# EAGLE design arduino stm32 vacuum cleaner (EAGLE 9.0.1)
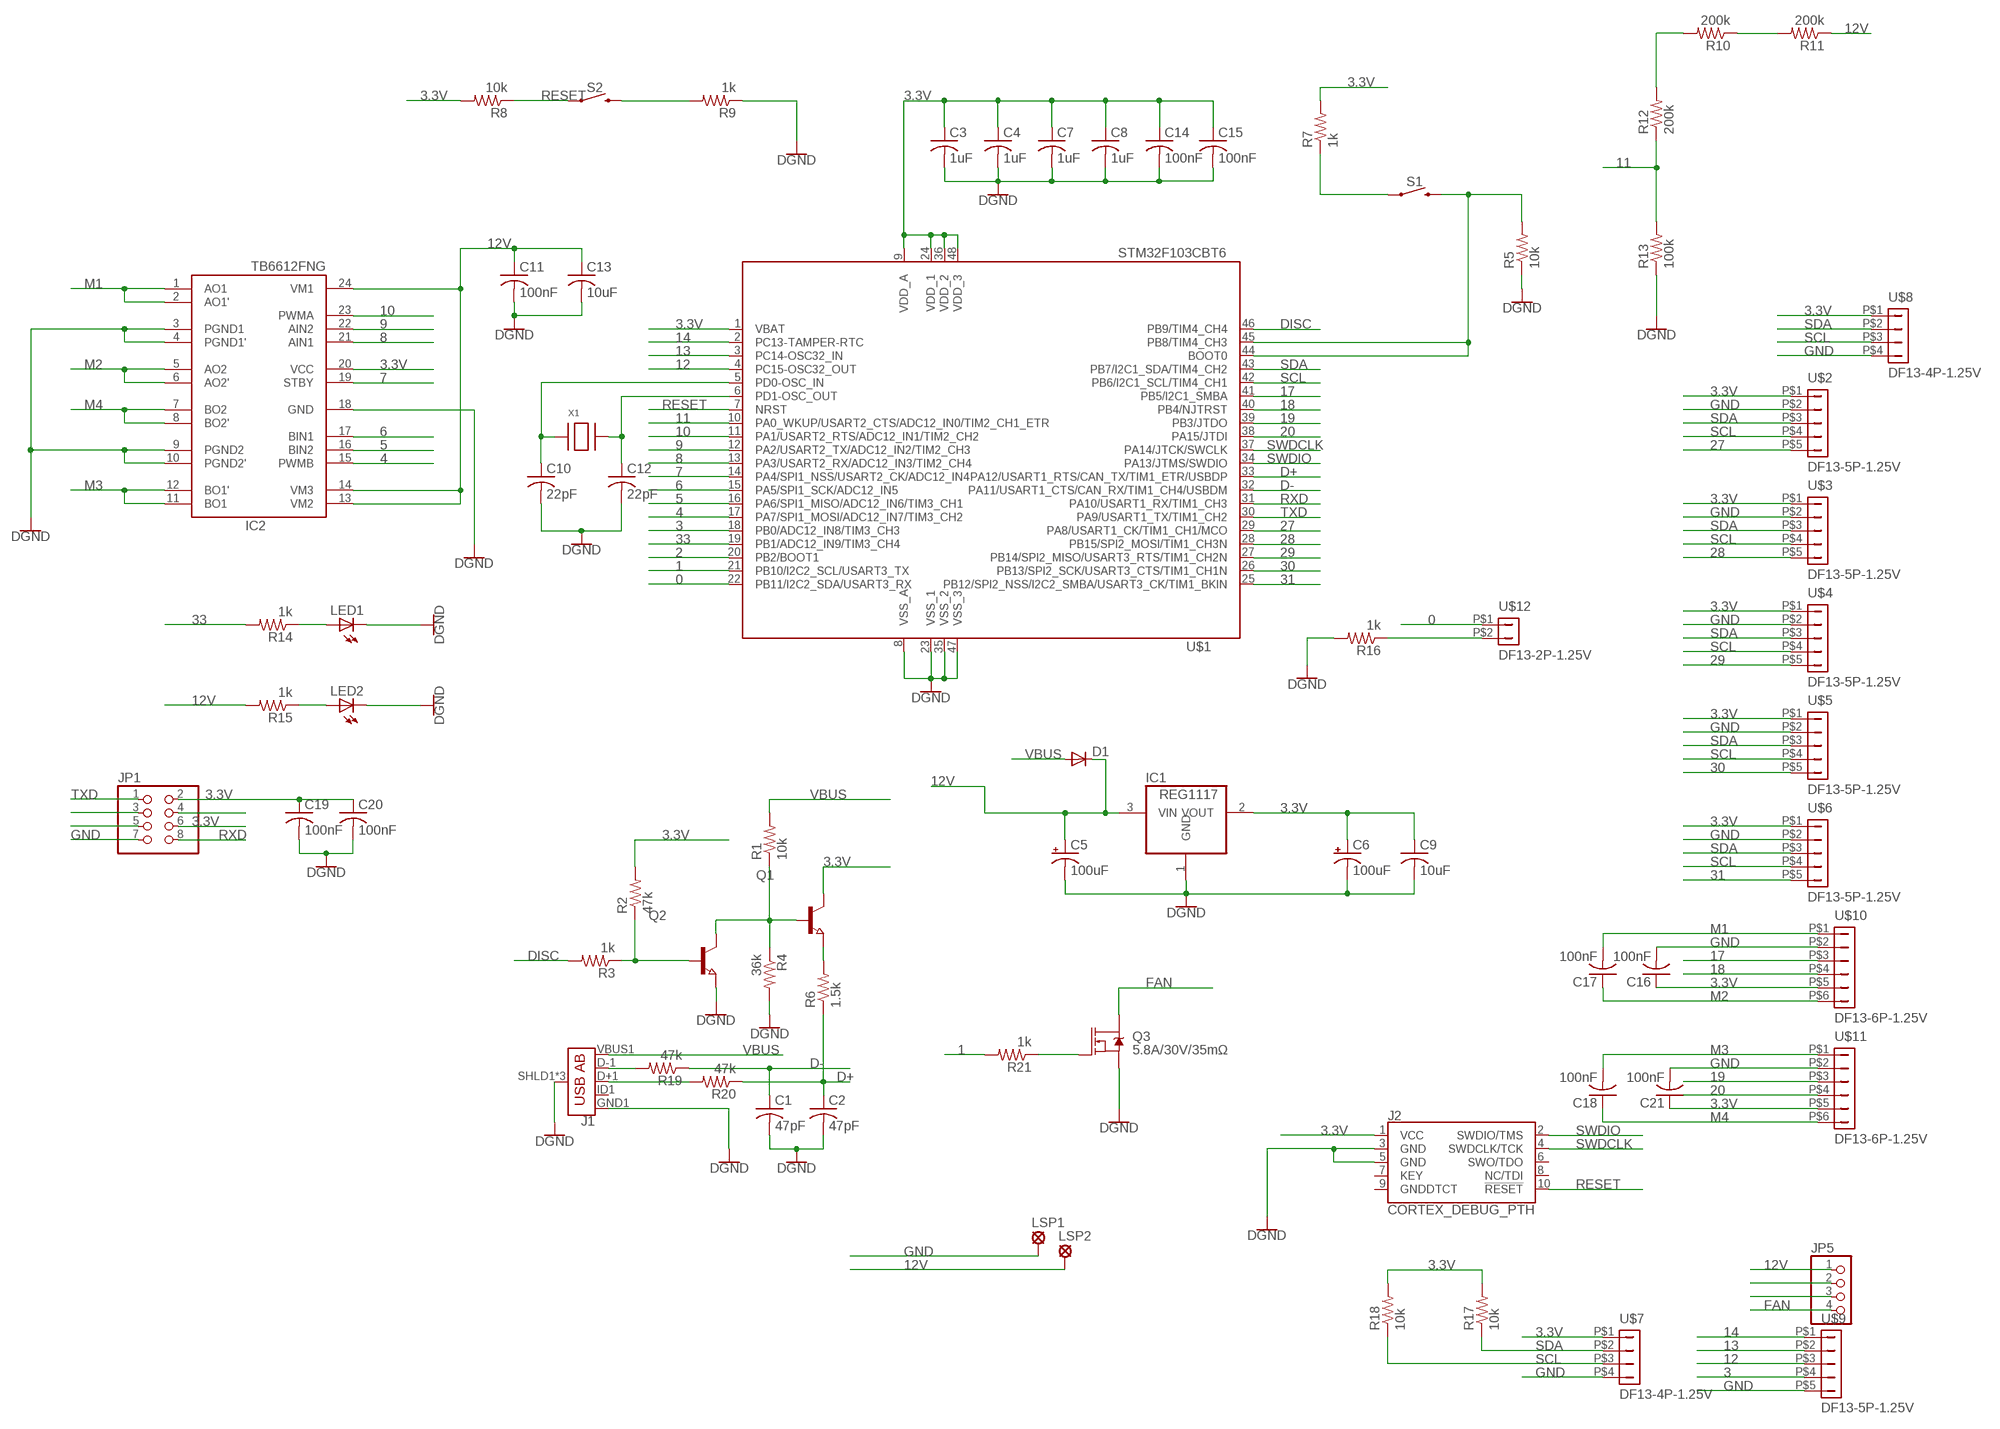
[diagram p0: schematic, sheet 1]

## Parts
C1  47pF  C-USC0805  [C0805]
C2  47pF  C-USC0805  [C0805]
C3  1uF  C-USC0805  [C0805]
C4  1uF  C-USC0805  [C0805]
C5  100uF  CPOL-USCT7343  [CT7343]
C6  100uF  CPOL-USCT7343  [CT7343]
C7  1uF  C-USC0805  [C0805]
C8  1uF  C-USC0805  [C0805]
C9  10uF  C-USC0805  [C0805]
C10  22pF  C-USC0805  [C0805]
C11  100nF  C-USC0805  [C0805]
C12  22pF  C-USC0805  [C0805]
C13  10uF  C-USC0805  [C0805]
C14  100nF  C-USC0805  [C0805]
C15  100nF  C-USC0805  [C0805]
C16  100nF  C-USC0805  [C0805]
C17  100nF  C-USC0805  [C0805]
C18  100nF  C-USC0805  [C0805]
C19  100nF  C-USC0805  [C0805]
C20  100nF  C-USC0805  [C0805]
C21  100nF  C-USC0805  [C0805]
D1  DIODE-SOD123  [SOD123]
IC1  REG1117  [SOT223]
IC2  TB6612FNG  [SSOP24]
J1  USB_AB_SMT  [USB-AB-MICRO-SMD]
J2  CORTEX_DEBUG_PTH  [2X5-PTH-1.27MM]
JP1  PINHD-2X4  [2X04]
JP5  PINHD-1X4  [1X04]
LED1  LEDCHIPLED_0603  [CHIPLED_0603]
LED2  LEDCHIPLED_0603  [CHIPLED_0603]
LSP1  SE14  [SE14]
LSP2  SE14  [SE14]
Q1  NPN-TRANSISTOR_SOT23  [SOT23]
Q2  NPN-TRANSISTOR_SOT23  [SOT23]
Q3  5.8A/30V/35mΩ  MOSFET-NCH-AO3404A  [SOT23-3]
R1  10k  R-US_R0805  [R0805]
R2  47k  R-US_R0805  [R0805]
R3  1k  R-US_R0805  [R0805]
R4  36k  R-US_R0805  [R0805]
R5  10k  R-US_R0805  [R0805]
R6  1.5k  R-US_R0805  [R0805]
R7  1k  R-US_R0805  [R0805]
R8  10k  R-US_R0805  [R0805]
R9  1k  R-US_R0805  [R0805]
R10  200k  R-US_R1206  [R1206]
R11  200k  R-US_R1206  [R1206]
R12  200k  R-US_R1206  [R1206]
R13  100k  R-US_R1206  [R1206]
R14  1k  R-US_R0805  [R0805]
R15  1k  R-US_R0805  [R0805]
R16  1k  R-US_R0805  [R0805]
R17  10k  R-US_R0805  [R0805]
R18  10k  R-US_R0805  [R0805]
R19  47k  R-US_R0805  [R0805]
R20  47k  R-US_R0805  [R0805]
R21  1k  R-US_R0805  [R0805]
S1  MOMENTARY-SWITCH-SPST-SMD-6.0X3.5MM  [TACTILE_SWITCH_SMD_6.0X3.5MM]
S2  MOMENTARY-SWITCH-SPST-SMD-6.0X3.5MM  [TACTILE_SWITCH_SMD_6.0X3.5MM]
U$1  STM32F103CBT6  [STM32_LQFP48]
U$2  DF13-5P-1.25V  [DF13C-5P-1.25V]
U$3  DF13-5P-1.25V  [DF13C-5P-1.25V]
U$4  DF13-5P-1.25V  [DF13C-5P-1.25V]
U$5  DF13-5P-1.25V  [DF13C-5P-1.25V]
U$6  DF13-5P-1.25V  [DF13C-5P-1.25V]
U$7  DF13-4P-1.25V  [DF13C-4P-1.25V]
U$8  DF13-4P-1.25V  [DF13C-4P-1.25V]
U$9  DF13-5P-1.25V  [DF13C-5P-1.25V]
U$10  DF13-6P-1.25V  [DF13C-6P-1.25V]
U$11  DF13-6P-1.25V  [DF13C-6P-1.25V]
U$12  DF13-2P-1.25V  [DF13C-2P-1.25V]
X1  XTALNX5032  [NX5032]

## Nets
0: U$1.22(PB11/I2C2_SDA/USART3_RX) U$12.P$1
1: R21.2 U$1.21(PB10/I2C2_SCL/USART3_TX)
2: U$1.20(PB2/BOOT1)
3: U$1.18(PB0/ADC12_IN8/TIM3_CH3) U$9.P$4
3.3V: C3.1 C4.1 C6.+ C7.1 C8.1 C9.1 C14.1 C15.1 C16.1 C19.1 C20.1 C21.1 IC1.2(VOUT) IC2.20(VCC) J2.1(VCC) JP1.2 JP1.6 Q1.3(C) R2.2 R7.2 R8.2 R17.2 R18.2 U$1.1(VBAT) U$1.9(VDD_A) U$1.24(VDD_1) U$1.36(VDD_2) U$1.48(VDD_3) U$2.P$1 U$3.P$1 U$4.P$1 U$5.P$1 U$6.P$1 U$7.P$1 U$8.P$1 U$10.P$5 U$11.P$5
4: IC2.15(PWMB) U$1.17(PA7/SPI1_MOSI/ADC12_IN7/TIM3_CH2)
5: IC2.16(BIN2) U$1.16(PA6/SPI1_MISO/ADC12_IN6/TIM3_CH1)
6: IC2.17(BIN1) U$1.15(PA5/SPI1_SCK/ADC12_IN5)
7: IC2.19(STBY) U$1.14(PA4/SPI1_NSS/USART2_CK/ADC12_IN4)
8: IC2.21(AIN1) U$1.13(PA3/USART2_RX/ADC12_IN3/TIM2_CH4)
9: IC2.22(AIN2) U$1.12(PA2/USART2_TX/ADC12_IN2/TIM2_CH3)
10: IC2.23(PWMA) U$1.11(PA1/USART2_RTS/ADC12_IN1/TIM2_CH2)
11: R12.1 R13.2 U$1.10(PA0_WKUP/USART2_CTS/ADC12_IN0/TIM2_CH1_ETR)
12: U$1.4(PC15-OSC32_OUT) U$9.P$3
12V: C5.+ C11.1 C13.1 D1.C IC1.3(VIN) IC2.13(VM2) IC2.14(VM3) IC2.24(VM1) JP5.1 LSP2.MP R11.1 R15.2
13: U$1.3(PC14-OSC32_IN) U$9.P$2
14: U$1.2(PC13-TAMPER-RTC) U$9.P$1
17: U$1.41(PB5/I2C1_SMBA) U$10.P$3
18: U$1.40(PB4/NJTRST) U$10.P$4
19: U$1.39(PB3/JTDO) U$11.P$3
20: U$1.38(PA15/JTDI) U$11.P$4
27: U$1.29(PA8/USART1_CK/TIM1_CH1/MCO) U$2.P$5
28: U$1.28(PB15/SPI2_MOSI/TIM1_CH3N) U$3.P$5
29: U$1.27(PB14/SPI2_MISO/USART3_RTS/TIM1_CH2N) U$4.P$5
30: U$1.26(PB13/SPI2_SCK/USART3_CTS/TIM1_CH1N) U$5.P$5
31: U$1.25(PB12/SPI2_NSS/I2C2_SMBA/USART3_CK/TIM1_BKIN) U$6.P$5
33: R14.2 U$1.19(PB1/ADC12_IN9/TIM3_CH4)
D+: C2.1 R6.1 R20.1 U$1.33(PA12/USART1_RTS/CAN_TX/TIM1_ETR/USBDP)
D-: C1.1 R19.1 U$1.32(PA11/USART1_CTS/CAN_RX/TIM1_CH4/USBDM)
DISC: R3.2 U$1.46(PB9/TIM4_CH4)
FAN: JP5.4 Q3.3(D)
GND: C1.2 C2.2 C3.2 C4.2 C5.- C6.- C7.2 C8.2 C9.2 C10.2 C11.2 C12.2 C13.2 C14.2 C15.2 C16.2 C19.2 C20.2 C21.2 IC1.1(GND) IC2.3(PGND1) IC2.4(PGND1') IC2.9(PGND2) IC2.10(PGND2') IC2.18(GND) J1.GND1(GND) J1.SHLD1(SHIELD) J1.SHLD2(SHIELD) J1.SHLD3(SHIELD) J2.3(GND) J2.5(GND) JP1.7 LED1.C LED2.C LSP1.MP Q2.2(E) Q3.2(S) R4.2 R5.1 R9.1 R13.1 R16.2 U$1.8(VSS_A) U$1.23(VSS_1) U$1.35(VSS_2) U$1.47(VSS_3) U$2.P$2 U$3.P$2 U$4.P$2 U$5.P$2 U$6.P$2 U$7.P$4 U$8.P$4 U$9.P$5 U$10.P$2 U$11.P$2 ; supply symbol labelled DGND
M1: C17.2 IC2.1(AO1) IC2.2(AO1') U$10.P$1
M2: C17.1 IC2.5(AO2) IC2.6(AO2') U$10.P$6
M3: C18.2 IC2.11(BO1) IC2.12(BO1') U$11.P$1
M4: C18.1 IC2.7(BO2) IC2.8(BO2') U$11.P$6
N$1: J1.D-1(D-) R19.2
N$2: J1.D+1(D+) R20.2
N$3: R5.2 S1.2 U$1.44(BOOT0) U$1.45(PB8/TIM4_CH3)
N$4: Q1.2(E) R6.2
N$5: Q1.1(B) Q2.3(C) R1.1 R4.1
N$6: C10.1 U$1.5(PD0-OSC_IN) X1.P$1
N$7: R7.1 S1.1
N$8: Q2.1(B) R2.1 R3.1
N$9: JP1.4
N$12: JP5.2
N$13: JP5.3
N$14: R16.1 U$12.P$2
N$15: R10.2 R12.2
N$17: JP1.3
N$19: Q3.1(G) R21.1
N$21: LED1.A R14.1
N$22: LED2.A R15.1
N$41: JP1.5
N$42: R10.1 R11.2
N$54: R9.2 S2.2
N$55: C12.1 U$1.6(PD1-OSC_OUT) X1.P$2
RESET: J2.10(!RESET) R8.1 S2.1 U$1.7(NRST)
RXD: JP1.8 U$1.31(PA10/USART1_RX/TIM1_CH3)
SCL: R18.1 U$1.42(PB6/I2C1_SCL/TIM4_CH1) U$2.P$4 U$3.P$4 U$4.P$4 U$5.P$4 U$6.P$4 U$7.P$3 U$8.P$3
SDA: R17.1 U$1.43(PB7/I2C1_SDA/TIM4_CH2) U$2.P$3 U$3.P$3 U$4.P$3 U$5.P$3 U$6.P$3 U$7.P$2 U$8.P$2
SWDCLK: J2.4(SWDCLK/TCK) U$1.37(PA14/JTCK/SWCLK)
SWDIO: J2.2(SWDIO/TMS) U$1.34(PA13/JTMS/SWDIO)
TXD: JP1.1 U$1.30(PA9/USART1_TX/TIM1_CH2)
VBUS: D1.A J1.VBUS1(VBUS) R1.2
Unconnected: J1.ID1(USBID) J2.6(SWO/TDO) J2.7(KEY) J2.8(NC/TDI) J2.9(GNDDTCT)

## Library data of the parts
C1-C4 C7-C21 = rcl:C-US: CAPACITOR, American symbol; SPICEPREFIX: C
C5 C6 = rcl:CPOL-US: POLARIZED CAPACITOR, American symbol; SPICEPREFIX: C
D1 = diode:DIODE-: DIODE
IC1 = burr-brown:REG1117: 800mA and 1A Low Dropout (LDO) Positive Regulator 1.8V, 2.5V, 2.85V, 3.3V, 5V, and Adj; MPN: REG1117; OC_FARNELL: 1097566; OC_NEWARK: 14P6981
IC2 = adafruit:TB6612FNG: TB6612FNG MOS dual H-bridge motor driver, 1.2A current 3.2A peak 3 or 5v logic and 3-15v motor
J1 = SparkFun-Connectors:USB_AB: USB Type AB Micro Connector OTG-compatible. 5 pins, 3 shield pins SparkFun Products: IOIO-OTG <https://www.sparkfun.com/products/13613> SparkFun SAMD21 Mini Breakout <https://www.sparkfun.com/products/13664>; PROD_ID: CONN-11794
J2 = SparkFun-Connectors:CORTEX_DEBUG: Cortex Debug Connector - 10 pin Supports JTAG debug, Serial Wire debug, and Serial Wire Viewer. PTH and SMD connector options available. General Connector Information <http://infocenter.arm.com/help/topic/com.arm.doc.faqs/attached/13634/cortex_debug_connectors.pdf> Products: PTH Connector <http://www.digikey.com/product-detail/en/cnc-tech/3220-10-0100-00/1175-1627-ND/3883661> -via Digi-Key SparkFun PSoc <https://www.sparkfun.com/products/13229> SparkFun T <https://www.sparkfun.com/products/13810>
JP1 = pinhead:PINHD-2X4: PIN HEADER
JP5 = pinhead:PINHD-1X4: PIN HEADER
LED1 LED2 = adafruit:LED: LED OSRAM: - CHIPLED LG R971, LG N971, LY N971, LG Q971, LY Q971, LO R971, LY R971 LH N974, LH R974 LS Q976, LO Q976, LY Q976 LO Q996 - Hyper CHIPLED LW Q18S LB Q993, LB Q99A, LB R99A - SideLED LS A670, LO A670, LY A670, LG A670, LP A670 LB A673, LV A673, LT A673, LW A673 LH A674 LY A675 LS A676, LA A676, LO A676, LY A676, LW A676 LS A679, LY A679, LG A679 - Hyper Micro SIDELED® LS Y876, LA Y876, LO Y876, LY Y876 LT Y87S - SmartLED LW L88C, LW L88S LB L89C, LB L89S, LG L890 LS L89K, LO L89K, LY L89K LS L896, LA L896, LO L896, LY L896 - TOPLED LS T670, LO T670, LY T670, LG T670, LP T670 LSG T670, LSP T670, LSY T670, LOP T670, LYG T670 LG T671, LOG T671, LSG T671 LB T673, LV T673, LT T673, LW T673 LH T674 LS T676, LA T676, LO T676, LY T676, LB T676, LH T676, LSB T676, LW T676 LB T67C, LV T67C, LT T67C, LS T67K, LO T67K, LY T67K, LW E67C LS E67B, LA E67B, LO E67B, LY E67B, LB E67C, LV E67C, LT E67C LW T67C LS T679, LY T679, LG T679 LS T770, LO T770, LY T770, LG T770, LP T770 LB T773, LV T773, LT T773, LW T773 LH T774 LS E675, LA E675, LY E675, LS T675 LS T776, LA T776, LO T776, LY T776, LB T776 LHGB T686 LT T68C, LB T68C - Hyper Mini TOPLED® LB M676 - Mini TOPLED Santana® LG M470 LS M47K, LO M47K, LY M47K Source: http://www.osram.convergy.de/
LSP1 LSP2 = solpad:SE14: SOLDER PAD E1553, drill 1,4mm, distributor Buerklin, 07F820
Q1 Q2 = semicon-smd-ipc:NPN-TRANSISTOR_: NPN TRANSISTOR
Q3 = SparkFun-DiscreteSemi:MOSFET-NCH: N-channel MOSFETs Voltage controlled devices that allow control of high current outputs. SparkFun Products: SparkFun OpenScale <https://www.sparkfun.com/products/13261> SparkFun Digital Sandbox <https://www.sparkfun.com/products/12651> SparkFun Monster Moto Shield <https://www.sparkfun.com/products/10182> SparkFun MOSFET Power Controller <https://www.sparkfun.com/products/11214>; PROD_ID: TRANS-12988
R1-R21 = rcl:R-US_: RESISTOR, American symbol; SPICEPREFIX: R
S1 S2 = SparkFun-Switches:MOMENTARY-SWITCH-SPST: Momentary Switch (Pushbutton) - SPST Normally-open (NO) SPST momentary switches (buttons, pushbuttons). Variants PTH-12MM - 12mm square, through-hole Momentary Pushbutton Switch - 12mm Square <https://www.sparkfun.com/products/9190> (COM-09190) PTH-6.0MM, PTH-6.0MM-KIT - 6.0mm square, through-hole Mini Pushbutton Switch <https://www.sparkfun.com/products/97> (COM-00097) KIT package intended for soldering kit's - only one side of pads' copper is exposed. PTH-RIGHT-ANGLE-KIT - Right-angle, through-hole Right Angle Tactile Button <https://www.sparkfun.com/products/10791> - Used on SparkFun BigTime Watch Kit <https://www.sparkfun.com/products/11734> SMD-12MM - 12mm square, surface-mount Tactile Button - SMD (12mm) <https://www.sparkfun.com/products/12993> (COM-12993) Used on SparkFun PicoBoard <https://www.sparkfun.com/products/11888> SMD-4.5MM - 4.5mm Square Trackball Switch Used on SparkFun Blackberry Trackballer Breakout <https://www.sparkfun.com/products/13169> SMD-4.6MMX2.8MM - 4.60mm x 2.80mm, surface mount Used on SparkFun SAMD21 Mini Breakout <https://www.sparkfun.com/products/13664> SMD-5.2MM, SMD-5.2-REDUNDANT - 5.2mm square, surface-mount Mini Pushbutton Switch - SMD <https://www.sparkfun.com/products/8720> (COM-08720) Used on Arduino Pro Mini <https://www.sparkfun.com/products/11114> REDUNDANT package connects both switch circuits together SMD-6.0X3.5MM - 6.0 x 3.5mm, surface mount Momentary Reset Switch SMD <https://www.sparkfun.com/products/8229> (COM-08229) SMD-6.2MM-TALL - 6.2mm square, surface mount Tactile Button - SMD (6mm) <https://www.sparkfun.com/products/12992> Used on SparkFun Digital Sandbox <https://www.sparkfun.com/products/12651> SMD-RIGHT-ANGLE - Right-angle, surface mount Used on SparkFun Block for Intel® Edison - Arduino <https://www.sparkfun.com/products/13036>; PROD_ID: SWCH-00815; SF_SKU: COM-08229
U$1 = STM32:STM32F103CBT6
U$2-U$6 U$9 = con-hirose-df13:DF13-5P-1.25: DF13-5P 1.25mm Pitch Miniature Crimping Connector.
U$7 U$8 = con-hirose-df13:DF13-4P-1.25: DF13-4P 1.25mm Pitch Miniature Crimping Connector.
U$10 U$11 = con-hirose-df13:DF13-6P-1.25: DF13-6P 1.25mm Pitch Miniature Crimping Connector.
U$12 = con-hirose-df13:DF13-2P-1.25: DF13-2P 1.25mm Pitch Miniature Crimping Connector.
X1 = adafruit:XTAL: Low cost SMT crystals, no capacitors included http://www.ladyada.net/library/eagle

## Board
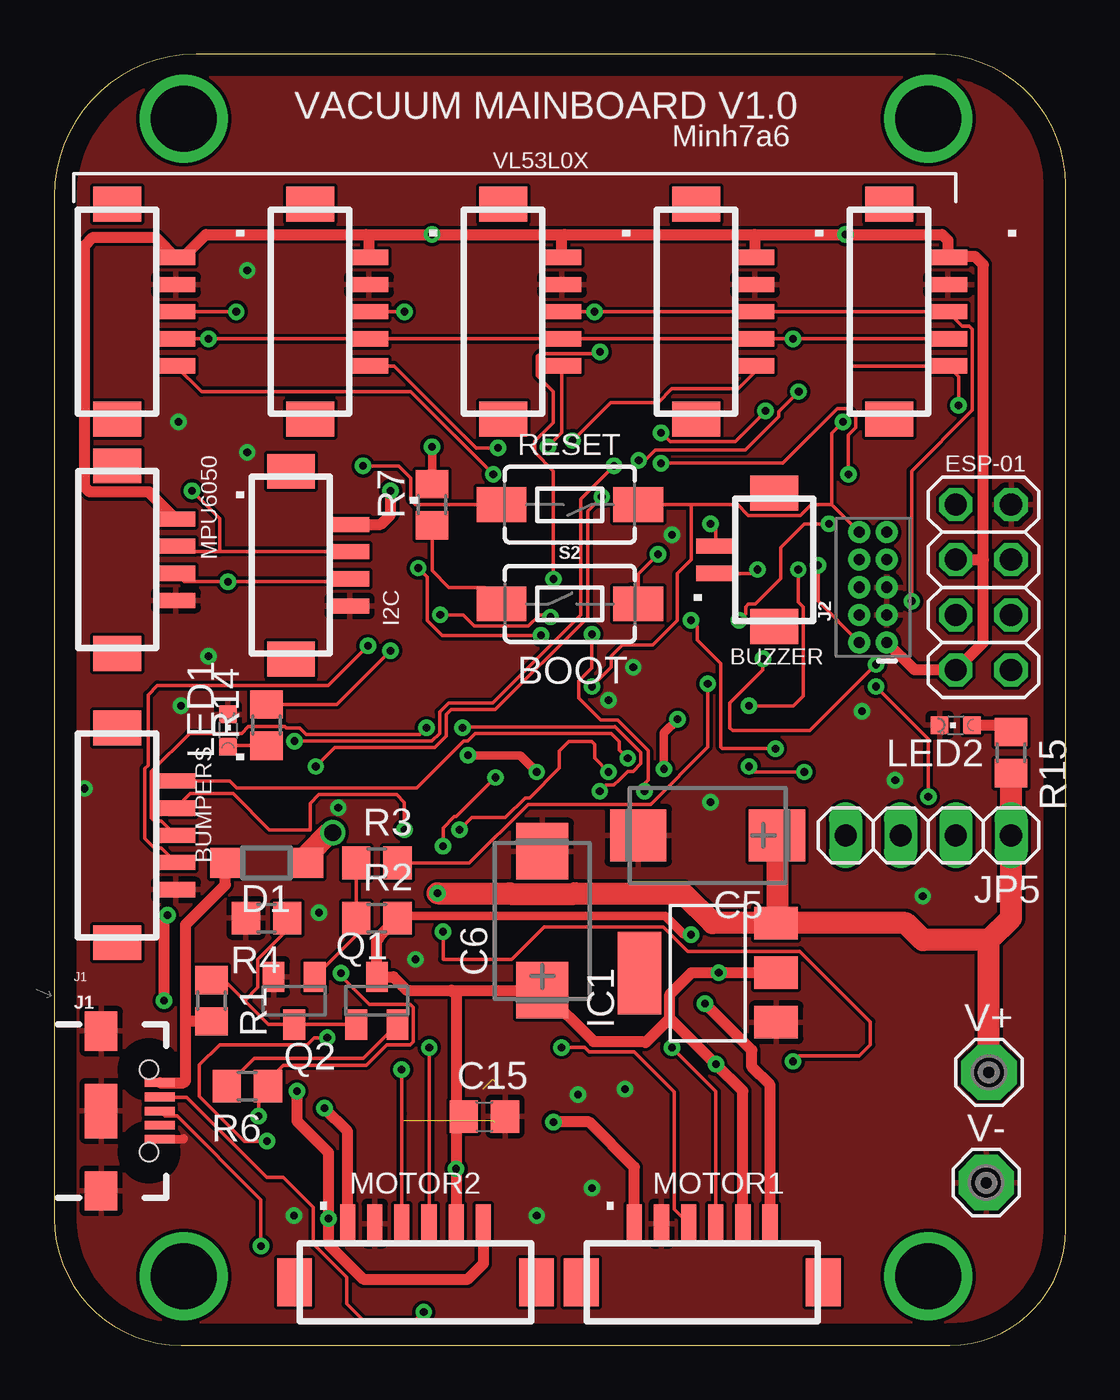
[diagram p1: board, top side]
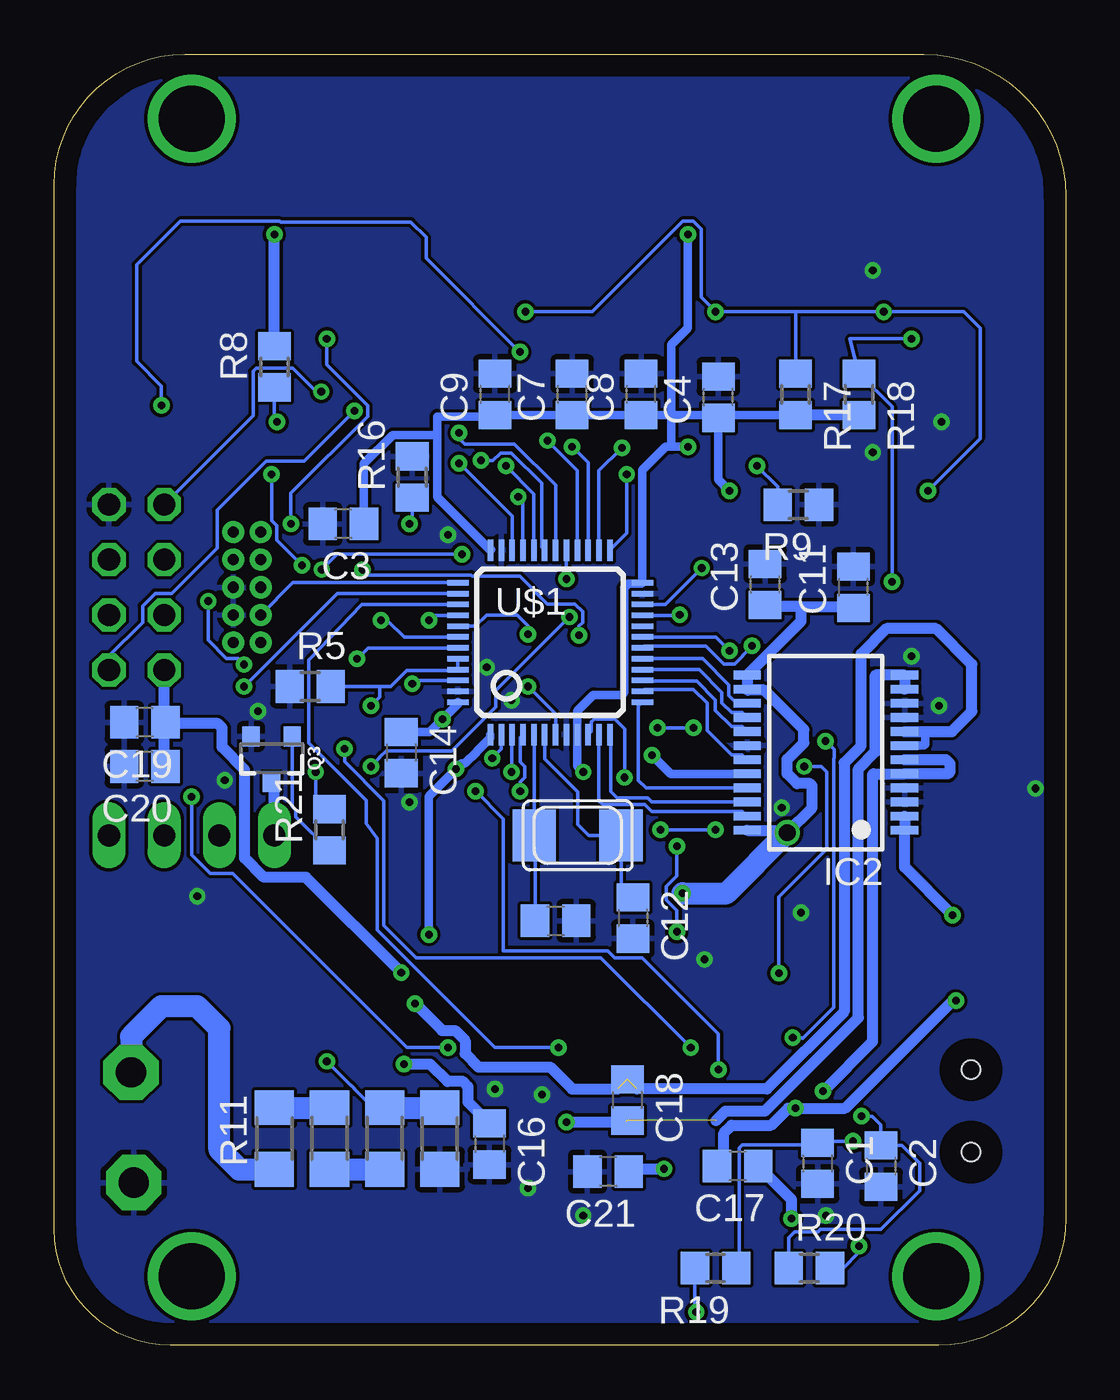
[diagram p2: board, bottom side, seen from below]

Size 46.59 x 59.49 mm. Coordinates in mm from the lower left corner, seen from the top.
Outline: 0,52.96 0,5.84 arc90 5.84,0 41.25,0 arc90 46.59,5.34 46.59,53.48 arc90 40.59,59.49 6.53,59.49 arc90 0,52.96
Copper layers (1*16): Top 0.035mm / dielectric 1.5mm / Bottom 0.035mm
Design rules "default": minimum track width 6mil, minimum drill 0.35mm, track to track 6mil, track to pad 6mil, pad to pad 6mil, via to via 6mil, smd to smd 6mil, copper to edge 40mil, drill to drill 6mil, minimum pad ring 10mil, minimum via ring 8mil, stop-mask expansion 4mil, vias tented up to drill 0mil, thermal gap 10mil

### Footprints (pad centres in the part's own frame; a part is rotated, then mirrored left to right if it is on the bottom)
C0805 = smd 1.3 x 1.5: 1 -0.95,0; 2 0.95,0
CT7343 = smd 2.6 x 2.4: + -3.2,0; - 3.2,0
SOD123 = smd 1.4 x 1.4: A 1.9,0; C -1.9,0
SOT223 = smd 1.499 x 2.007: 1 -2.261,-3.15; 2 0.025,-3.15; 3 2.311,-3.15 | smd 3.81 x 2.007: 4 0,3.15
SSOP24 = smd 0.4 x 1.25: 1 -3.575,-3.625; 2 -2.925,-3.625; 3 -2.275,-3.625; 4 -1.625,-3.625; 5 -0.975,-3.625; 6 -0.325,-3.625; 7 0.325,-3.625; 8 0.975,-3.625; 9 1.625,-3.625; 10 2.275,-3.625; 11 2.925,-3.625; 12 3.575,-3.625; 13 3.575,3.625; 14 2.925,3.625; 15 2.275,3.625; 16 1.625,3.625; 17 0.975,3.625; 18 0.325,3.625; 19 -0.325,3.625; 20 -0.975,3.625; 21 -1.625,3.625; 22 -2.275,3.625; 23 -2.925,3.625; 24 -3.575,3.625
USB-AB-MICRO-SMD = smd 1.4 x 0.4: D+1 2.7,0; D-1 2.7,0.65; GND1 2.7,-1.3; ID1 2.7,-0.65; VBUS1 2.7,1.3 | smd 1.5 x 1.8: SHLD1 0,-3.68; SHLD2 0,3.68 | smd 1.5 x 2.5: SHLD3 0,0 | hole 0.85: 2.2,1.9; 2.2,-1.9
2X5-PTH-1.27MM = drill 0.508 pad 1: 1 -2.54,-0.635; 2 -2.54,0.635; 3 -1.27,-0.635; 4 -1.27,0.635; 5 0,-0.635; 6 0,0.635; 7 1.27,-0.635; 8 1.27,0.635; 9 2.54,-0.635; 10 2.54,0.635
2X04 = drill 1.016 octagon: 1 -3.81,-1.27; 2 -3.81,1.27; 3 -1.27,-1.27; 4 -1.27,1.27; 5 1.27,-1.27; 6 1.27,1.27; 7 3.81,-1.27; 8 3.81,1.27
1X04 = drill 1.016 long: 1 -3.81,0; 2 -1.27,0; 3 1.27,0; 4 3.81,0
CHIPLED_0603 = smd 0.8 x 0.8: A 0,-0.75; C 0,0.75
SE14 = drill 1.397 pad 2.54 octagon: MP 0,0
SOT23 = smd 1 x 1.4: 1 -0.95,-1.1; 2 0.95,-1.1; 3 0,1.1
SOT23-3 = smd 0.8 x 0.9: 1 -0.95,-1; 2 0.95,-1; 3 0,1.1
R0805 = smd 1.3 x 1.5: 1 -0.95,0; 2 0.95,0
R1206 = smd 1.6 x 1.803: 1 -1.422,0; 2 1.422,0
TACTILE_SWITCH_SMD_6.0X3.5MM = smd 2.3 x 1.6: 1 -3.15,0; 2 3.15,0
STM32_LQFP48 = smd 0.254 x 1: 1 -2.75,-4.25; 2 -2.25,-4.25; 3 -1.75,-4.25; 4 -1.25,-4.25; 5 -0.75,-4.25; 6 -0.25,-4.25; 7 0.25,-4.25; 8 0.75,-4.25; 9 1.25,-4.25; 10 1.75,-4.25; 11 2.25,-4.25; 12 2.75,-4.25; 25 2.75,4.25; 26 2.25,4.25; 27 1.75,4.25; 28 1.25,4.25; 29 0.75,4.25; 30 0.25,4.25; 31 -0.25,4.25; 32 -0.75,4.25; 33 -1.25,4.25; 34 -1.75,4.25; 35 -2.25,4.25; 36 -2.75,4.25 | smd 1 x 0.254: 13 4.25,-2.75; 14 4.25,-2.25; 15 4.25,-1.75; 16 4.25,-1.25; 17 4.25,-0.75; 18 4.25,-0.25; 19 4.25,0.25; 20 4.25,0.75; 21 4.25,1.25; 22 4.25,1.75; 23 4.25,2.25; 24 4.25,2.75; 37 -4.25,2.75; 38 -4.25,2.25; 39 -4.25,1.75; 40 -4.25,1.25; 41 -4.25,0.75; 42 -4.25,0.25; 43 -4.25,-0.25; 44 -4.25,-0.75; 45 -4.25,-1.25; 46 -4.25,-1.75; 47 -4.25,-2.25; 48 -4.25,-2.75
DF13C-5P-1.25V = smd 1.6 x 2.2: M$0 4.95,-1.8; M$1 -4.95,-1.8 | smd 0.7 x 1.8: P$1 -2.5,0.9; P$2 -1.25,0.9; P$3 0,0.9; P$4 1.25,0.9; P$5 2.5,0.9
DF13C-4P-1.25V = smd 1.6 x 2.2: M$0 4.325,-1.8; M$1 -4.325,-1.8 | smd 0.7 x 1.8: P$1 -1.875,0.9; P$2 -0.625,0.9; P$3 0.625,0.9; P$4 1.875,0.9
DF13C-6P-1.25V = smd 1.6 x 2.2: M$0 5.575,-1.8; M$1 -5.575,-1.8 | smd 0.7 x 1.8: P$1 -3.125,0.9; P$2 -1.875,0.9; P$3 -0.625,0.9; P$4 0.625,0.9; P$5 1.875,0.9; P$6 3.125,0.9
DF13C-2P-1.25V = smd 1.6 x 2.2: M$0 3.075,-1.8; M$1 -3.075,-1.8 | smd 0.7 x 1.8: P$1 -0.625,0.9; P$2 0.625,0.9
NX5032 = smd 2 x 2.4: P$1 2,0; P$2 -2,0

### Placement (x,y rotation side)
C1  11.43,8.38 270 bottom
C2  8.51,8.25 270 bottom
C3  33.27,37.85 180 bottom
C4  16,43.69 90 bottom
C5  30.1,23.5 180 top
C6  22.48,19.56 90 top
C7  22.73,43.81 90 bottom
C8  19.56,43.81 90 bottom
C9  26.29,43.81 90 bottom
C10  23.5,19.56 0 bottom
C11  9.78,34.92 90 bottom
C12  19.94,19.69 270 bottom
C13  13.84,35.05 90 bottom
C14  30.61,27.3 270 bottom
C15  19.81,10.54 0 top
C16  26.54,9.27 270 bottom
C17  15.11,8.25 180 bottom
C18  20.19,11.3 270 bottom
C19  42.42,28.7 180 bottom
C20  42.42,26.67 180 bottom
C21  21.08,8 180 bottom
D1  9.78,22.23 180 top
IC1  30.1,17.14 90 top
IC2  11.05,27.3 90 bottom
J1  2.16,10.79 0 top
J2  37.72,34.92 90 top
JP1  42.8,34.92 90 top
JP5  40.26,23.5 180 top
LED1  8,28.32 0 top
LED2  41.53,28.57 90 top
LSP1  42.93,7.49 0 top
LSP2  43.05,12.57 0 top
Q1  14.86,15.88 0 top
Q2  11.05,15.88 180 top
Q3  36.58,27.05 180 bottom
R1  7.24,15.88 270 top
R2  14.86,19.69 0 top
R3  14.86,22.23 0 top
R4  9.78,19.69 180 top
R5  34.8,30.35 0 bottom
R6  8.89,11.94 180 top
R7  17.4,38.73 90 top
R8  36.45,45.08 90 bottom
R9  12.32,38.73 180 bottom
R10  33.91,9.53 270 bottom
R11  36.45,9.53 90 bottom
R12  31.37,9.53 270 bottom
R13  28.83,9.53 90 bottom
R14  9.78,28.57 90 top
R15  44.07,27.3 270 top
R16  30.1,40 90 bottom
R17  12.45,43.81 270 bottom
R18  9.53,43.81 270 bottom
R19  16.13,3.56 180 bottom
R20  11.81,3.56 0 bottom
R21  33.91,23.75 90 bottom
S1  23.75,34.16 0 top
S2  23.75,38.73 180 top
U$1  23.75,32.39 0 bottom
U$2  40.26,47.62 270 top
U$3  31.37,47.62 270 top
U$4  22.48,47.62 270 top
U$5  13.59,47.62 270 top
U$6  4.7,47.62 270 top
U$7  12.7,35.94 270 top
U$8  4.7,36.2 270 top
U$9  4.7,23.5 270 top
U$10  16.64,4.7 0 top
U$11  29.84,4.7 0 top
U$12  31.37,36.2 90 top
X1  22.48,23.5 180 bottom

### Tracks (layer width: path | path; a pad name or v marks a point on that pad's centre or on a via)
0  (via drill 0.35)
  Top 0.152: v16.76,35.81 17.17,35.41 17.17,33.4 17.87,32.71 v22.42,32.71 | U$12.P$1 32.21,35.57 v32.38,35.74
  Bottom 0.152: U$1.22 18.44,34.14 v16.76,35.81 | v22.42,32.71 22.42,33.14 22.25,33.3 22.25,33.81 22.61,34.16 23.88,34.16 25.15,35.43 27.35,35.43 27.4,35.49 32.13,35.49 v32.38,35.74
1  (via drill 0.35)
  Top 0.152: v22.86,33.56 22.76,33.66 22.36,33.66 21.84,33.13 19.35,33.13 18.83,33.66 v17.78,33.66 | v32,26.67 32.26,26.42 v34.54,26.42
  Bottom 0.152: U$1.21 17.8,33.64 v17.78,33.66 | v22.86,33.56 26.25,30.16 26.25,29.42 28.29,27.38 31.31,27.38 31.59,27.1 31.59,27.09 v32,26.67 | v34.54,26.42 34.54,25.33 R21.2
3  (via drill 0.35)
  Top 0.152: U$9.P$4 4.93,22.92 4.6,22.92 4.17,23.36 4.17,26.57 4.32,26.72 4.32,29.97 4.75,30.4 12.62,30.4 v14.44,32.22
  Bottom 0.152: U$1.18 19.41,32.22 16.57,32.22 15.75,31.4 15.24,31.4 14.89,31.75 14.89,31.78 v14.44,32.22
3.3V  (via drill 0.35)
  Top 0.381: v17.4,41.4 R7.2 | v19.05,27.18 21.46,27.18 v22.23,26.42 | v29.34,18.92 29,18.92 28.15,19.77 15.89,19.77 R2.2 | v28.08,26.55 28.08,28.21 v28.71,28.84
  Top 0.508: 28.36,15.07 28.36,16.17 29.36,17.17 v30.61,17.17 IC1.2 | 27.23,13.95 27.28,13.99 | 27.28,13.99 28.36,15.07 | R2.2 14.96,18.84 14.96,18.77 14.86,18.66 Q1.3 15.61,16.98 16.23,16.36 18.29,16.36 | 14.35,51.18 6.98,51.18 5.93,50.12 U$6.P$1 4.67,51.05 1.78,51.05 1.39,50.67 1.39,39.55 1.63,39.31 4.35,39.31 U$8.P$1 | 14.35,51.18 14.49,51.04 U$5.P$1 | 14.35,51.18 v17.4,51.18 23.5,51.18 | 23.5,51.18 32.26,51.18 | 32.26,51.18 32.27,51.17 U$3.P$1 | 32.26,51.18 v36.45,51.18 40.89,51.18 41.16,50.92 U$2.P$1 41.2,50.17 42.42,50.17 42.8,49.78 42.8,36.2 | 42.8,36.2 42.8,32.39 JP1.2 39.62,31.11 J2.1 | U$11.P$5 31.72,11.71 v30.48,12.95 28.36,15.07 | 18.29,16.36 C6.+ 24.84,13.99 27.28,13.99 | 18.29,16.36 18.51,16.13 18.51,10.54 | U$7.P$1 15.03,37.82 15.49,38.28 v15.49,39.37 | 18.51,10.54 v18.51,8.13 U$10.P$5 | JP1.6 42.8,36.2 | U$4.P$1 23.38,51.06 23.5,51.18 | C15.1 18.51,10.54
  Bottom 0.381: 26.47,36.66 U$1.36 28.96,39.09 28.96,42.04 | v17.4,41.4 18.16,41.4 | 18.16,41.4 18.41,41.4 19.5,40.32 U$1.24 19.53,35.11 20.14,35.11 20.34,34.9 20.34,30.08 20.45,29.97 21.76,29.97 22.5,29.23 U$1.9 22.5,26.69 v22.23,26.42 | IC2.20 18.2,26.33 v19.05,27.18 | 28.96,42.04 28.96,42.8 26.54,42.8 | 26.54,42.8 26.36,42.8 C9.1 | U$1.48 27.95,29.59 v28.71,28.84 29.29,28.25 C14.1 | v29.34,18.92 29.34,25.3 v28.08,26.55 27.84,26.8 27.69,26.8 27.14,27.35 26.71,27.77 26.5,27.98 U$1.1 | R17.2 16.38,42.86 | 16.38,42.86 C4.1 16,39.88 v15.49,39.37 | 18.29,42.86 C8.1 C7.1 26.48,42.86 26.54,42.8 | 18.29,42.86 16.38,42.86 | v17.4,51.18 17.4,46.86 18.16,46.1 18.16,42.99 18.29,42.86 | 18.16,41.4 18.16,42.74 18.29,42.86 | 28.96,42.04 29.04,41.95 30.99,41.95 32.32,40.61 C3.1
  Bottom 0.508: R8.2 v36.45,51.18 | 41.53,28.64 JP1.2 | v30.61,17.17 35,21.56 36.93,21.56 37.82,22.45 37.82,26.52 38.86,27.56 38.86,28.45 39.05,28.64 41.53,28.64 | R18.2 R17.2 | v30.48,12.95 29.27,12.95 28.48,12.15 27.76,12.15 27.52,11.91 27.52,11.2 C16.1 | C19.1 41.53,28.64 | C20.1 41.53,26.73 41.53,28.64 | C21.1 20,8.13 v18.51,8.13
4
  Bottom 0.152: U$1.17 16.73,31.64 15.53,30.43 15.53,29.93 15.3,29.7 14.8,29.7 IC2.15
5
  Bottom 0.152: U$1.16 16.88,31.14 15.83,30.09 15.83,29.59 15.39,29.15 14.89,29.15 IC2.16
6
  Bottom 0.152: IC2.17 14.89,28.5 15.39,28.5 16.14,29.25 16.14,29.74 17,30.61 19.47,30.61 U$1.15
7
  Bottom 0.152: IC2.19 14.89,27.2 15.39,27.2 16.51,28.32 16.51,29.59 17.14,30.23 19.41,30.23 U$1.14
8
  Bottom 0.152: IC2.21 19.33,25.68 19.68,26.04 19.68,29.45 U$1.13
9
  Bottom 0.152: IC2.22 19.06,25.03 19.26,25.23 20.66,25.23 20.95,25.53 20.95,28.09 U$1.12
10
  Bottom 0.152: IC2.23 14.89,24.6 19.06,24.6 19.38,24.92 21.34,24.92 21.5,25.09 U$1.11
11  (via drill 0.35)
  Top 0.152: v20.32,26.16 18.51,24.36 18.42,24.36 17.91,23.84 v17.91,22.99 | 34.16,13.21 v34.04,13.08 34.29,13.34 37.08,13.34 37.59,13.84 37.59,14.9 34.35,18.15 29.18,18.15 28.05,19.28 22.58,19.28 21.08,17.78 17.91,17.78 v17.91,19.05
  Bottom 0.152: U$1.10 21.86,28.28 21.86,28.73 21.72,28.86 20.78,28.86 20.32,28.41 v20.32,26.16 | v17.91,22.99 17.91,21.62 18.39,21.13 18.39,20.52 17.91,20.04 v17.91,19.05 | R12.1 31.9,10.95 32.78,11.82 32.78,11.84 32.91,11.98 32.93,11.98 v34.04,13.08
  Bottom 1.016: R12.1 R13.2
12  (via drill 0.35)
  Top 0.152: U$9.P$3 4.93,24.17 4.6,24.17 4.47,24.3 4.47,26.44 6.23,28.2 8.63,28.2 8.93,28.5 10.62,28.5 10.68,28.45 11.31,28.45 11.61,28.15 16.84,28.15 v17.14,28.45 | 25.82,28.5 25.83,28.5 | 25.83,28.5 27.02,27.3 27.02,26.8 26.67,26.44 26.41,26.44 26.13,26.16 26.02,26.05 25.78,25.81 25.41,25.81 v25.13,25.53 | 25.83,28.5 18.84,28.5 v18.8,28.45
  Bottom 0.152: U$1.4 25.13,28.01 25.13,26.88 24.92,26.67 24.92,26.16 25.13,25.96 v25.13,25.53 | v18.8,28.45 v17.14,28.45
12V  (via drill 0.35, 0.76)
  Top 1.016: R15.2 JP5.1 44.07,19.69 43.05,18.67 | v12.83,23.62 12.7,23.62 11.68,22.6 D1.C | v17.65,20.83 20.98,20.83 21,20.8 23.95,20.8 23.98,20.83 28.96,20.83 30.33,19.46 IC1.3 | C5.+ 33.3,19.51 IC1.3 | IC1.3 39.22,19.46 40.01,18.67 43.05,18.67 | LSP2.MP 43.05,18.67
  Bottom 0.508: IC2.24 12.94,23.73 v12.83,23.62 11.68,24.77 11.68,25.78 11.79,25.89 12.37,25.89 12.83,26.34 12.83,27 12.06,27.76 12.06,28.37 13.88,30.19 14.63,30.19 IC2.14 IC2.13 12.19,33.36 12.19,34.04 | 12.19,34.04 13.78,34.04 C13.1 | 12.19,34.04 9.84,34.04 C11.1
  Bottom 1.016: R11.1 38.08,8.1 38.99,9.02 38.99,14.61 40.01,15.62 41.66,15.62 43.05,14.22 LSP2.MP | v17.65,20.83 15.62,20.83 v12.83,23.62
13  (via drill 0.35)
  Top 0.152: U$9.P$2 6.27,25.42 8.24,25.42 9.91,23.75 11.79,23.75 11.79,24.97 12.19,25.37 15.77,25.37 16.13,25.02 v16.13,23.75 | v18.67,23.75 19.23,24.31 20.78,24.31 21.7,25.23 21.9,25.23 23.27,26.6 23.27,27.38 23.7,27.81 24.77,27.81 24.89,27.69 24.89,27.05 v25.53,26.42
  Bottom 0.152: v25.53,26.42 25.53,28.11 U$1.3 | v18.67,23.75 v16.13,23.75
14  (via drill 0.35)
  Top 0.152: v26.42,27.05 26.04,27.43 26.04,27.81 25.65,28.19 19.4,28.19 19.05,27.84 18.86,27.84 16.69,25.68 8.41,25.68 8.09,26 U$9.P$1
  Bottom 0.152: v26.42,27.05 26,27.47 U$1.2
17  (via drill 0.35)
  Top 0.152: v27.18,25.53 27.18,25.86 27.36,26.04 27.36,27.4 25.95,28.81 25.17,28.81 24.16,29.82 24.16,30.6 24.77,31.21 v24.77,32.77 | v16,12.7 16,10.69 16.01,10.68 U$10.P$3
  Bottom 0.152: v16,12.7 16,14.35 19.5,17.86 20.78,17.86 21.09,18.16 25.91,18.16 25.91,24.26 v27.18,25.53 | U$1.41 27.19,33.14 26.67,33.66 25.27,33.66 24.77,33.15 v24.77,32.77
18  (via drill 0.35)
  Top 0.152: v29.34,33.4 29.62,33.12 29.62,32.49 30.71,31.4 30.71,27.56 30.78,27.49 v33.22,27.49 | v17.27,13.72 17.27,5.61 U$10.P$4
  Bottom 0.152: v17.27,13.72 21.41,17.86 29.92,17.86 31.42,19.35 31.42,25.09 33.22,26.89 v33.22,27.49 | v29.34,33.4 29.1,33.64 U$1.40
19  (via drill 0.35)
  Top 0.152: v23.37,13.72 24.44,13.72 24.64,13.51 26.71,13.51 28.55,11.67 28.55,6.27 U$11.P$3
  Bottom 0.152: U$1.39 28.13,34.14 32.42,34.14 34.86,31.57 34.86,27.76 32.21,25.11 32.21,24.04 31.72,23.36 31.72,19.15 26.29,13.72 v23.37,13.72
20  (via drill 0.35)
  Top 0.152: v28.45,13.72 30.47,11.69 U$11.P$4 | v40.26,25.27 40.26,27.94 v37.85,30.35
  Bottom 0.152: U$1.38 33.56,34.64 v37.85,30.35 | v28.45,13.72 30.35,13.72 38.38,21.74 39.4,21.74 40.26,22.6 v40.26,25.27
27  (via drill 0.35)
  Top 0.152: 36.8,45.12 U$2.P$5 41.66,44.63 v41.66,43.31 | v22.99,35.31 22.99,40.29 22.13,41.15 22.13,41.65 22.99,42.51 22.99,43.94 22.25,44.68 22.25,45.57 22.38,45.7 25.08,45.7 v25.14,45.77
  Bottom 0.152: U$1.29 23,35.32 v22.99,35.31 | v41.66,43.31 41.66,44.2 42.8,45.34 42.8,49.78 40.8,51.79 36.2,51.79 36.16,51.75 30.16,51.75 29.46,51.05 29.46,50.09 v25.14,45.77
28  (via drill 0.35)
  Top 0.152: U$3.P$5 32.27,44.84 31.5,44.07 28.45,44.07 27.81,43.43 25.63,43.43 v23.88,41.68
  Bottom 0.152: v23.88,41.68 22.5,40.31 U$1.28
29  (via drill 0.35)
  Top 0.152: v22.73,41.4 23.38,42.05 U$4.P$5
  Bottom 0.152: U$1.27 22,40.67 v22.73,41.4
30  (via drill 0.35)
  Top 0.152: U$5.P$5 15.66,45.12 19.44,41.34 v20.45,41.34
  Bottom 0.152: v20.45,41.34 21.5,40.29 U$1.26
31  (via drill 0.35)
  Top 0.152: v20.22,40.13 16.41,43.94 11.68,43.94 6.78,43.94 U$6.P$5
  Bottom 0.152: U$1.25 20.22,37.41 v20.22,40.13
33  (via drill 0.35)
  Top 0.152: v15.49,32 13.02,29.52 R14.2
  Bottom 0.152: U$1.19 16.12,32.64 v15.49,32
D+  (via drill 0.35)
  Top 0.152: v13.21,17.14 13.21,17 14.5,15.7 16.4,15.7 16.54,15.57 16.54,13.98 16.4,13.85 15.31,13.85 14.37,12.9 10.54,12.9 9.84,12.2 R6.1 9.41,11.51 v9.41,10.56 | v12.04,26.67 12.91,27.54 17.52,27.54 18.06,28.07 18.06,29.06 18.29,29.29 20.32,29.29 24.56,33.53 24.56,38.44 v25.22,39.09
  Bottom 0.152: U$1.33 25,38.87 v25.22,39.09 | 12.09,26.62 v12.04,26.67 11.25,26.67 11,26.42 11,22.86 13.21,20.65 v13.21,17.14 | R20.1 12.76,4.95 12.48,5.23 11.4,5.23 11.3,5.33 8.51,5.33 6.73,7.11 6.73,8.38 7.55,9.21 C2.1 8.51,10.16 8.91,10.56 v9.41,10.56
D-  (via drill 0.35)
  Top 0.152: v12.57,14.17 11.96,14.17 11.64,13.85 7.62,13.85 6.68,12.91 6.68,11.47 8.76,9.4 v9.79,9.4 | v11.06,27.84 17.4,27.84 17.75,28.2 17.75,29.18 18.16,29.59 20.19,29.59 24.26,33.66 24.26,38.99 v25.78,40.51
  Bottom 0.152: U$1.32 24.5,39.23 v25.78,40.51 | v11.06,27.84 10.67,27.45 10.67,27.06 10.69,27.04 10.69,15.56 12.11,14.14 12.14,14.17 v12.57,14.17 | R19.1 15.04,3.69 15.04,9.1 14.91,9.23 11.53,9.23 C1.1 11.36,9.4 v9.79,9.4
DISC  (via drill 0.35)
  Top 0.152: v30.1,30.48 30.1,27.56 27.46,24.92 21.82,24.92 19.12,22.23 R3.2
  Bottom 0.152: U$1.46 29.94,30.64 v30.1,30.48
FAN
  Bottom 0.508: JP5.4 36.45,25.82 Q3.3
GND  (via drill 0.35)
  Top 0.381: J1.GND1 5.94,9.49 5.97,9.53
  other vias: 38.73,26.04 37.21,29.21 40.01,20.7 25.53,29.72 16.64,17.78 13.08,24.77 7.11,31.75 1.4,25.65 5.84,29.46 8.89,49.53 5.71,42.55 8.89,41.15 30.23,25.02 11.05,5.97 24.13,11.56 22.23,5.97 26.29,11.81 24.77,7.24 12.19,19.94 28.45,37.34 26.67,31.24
  pour Top: -1.02,61.59 -1.14,-0.63 48.13,-0.76 48.26,61.47
  pour Bottom: -1.65,62.86 -1.65,-1.4 47.88,-1.4 47.88,62.86
M1  (via drill 0.35)
  Top 0.508: v5.06,15.88 5.06,19.66 v5.21,19.81 | U$10.P$1 13.51,9.14 13.51,9.86 v12.45,10.92
  Bottom 0.508: IC2.2 IC2.1 7.42,22.03 v5.21,19.81 | v5.06,15.88 5.21,15.88 10.16,10.92 v12.45,10.92 12.78,10.92 13.57,10.13 15.39,10.13 15.75,9.78 15.75,8.57 C17.2
M2  (via drill 0.35)
  Top 0.508: v11.18,11.71 11.18,10.34 12.63,8.88 v12.63,5.84 12.63,4.65 14.24,3.05 19.05,3.05 19.76,3.76 U$10.P$6
  Bottom 0.508: v11.18,11.71 8.89,13.99 8.89,26.29 8.85,26.33 IC2.5 5.42,26.33 5.33,26.42 5.33,26.8 5.52,26.98 IC2.6 | C17.1 12.63,6.72 v12.63,5.84
M3  (via drill 0.35)  (2 unrouted)
  Top 0.508: U$11.P$1 26.72,8.21 24.64,10.29 v22.99,10.29
  Bottom 0.508: IC2.11 IC2.12 8.76,30.88 8.76,27.35 9.55,26.56 9.55,15.09 13.84,10.79 15.67,10.79 16.11,10.35 | v22.99,10.29 20.26,10.29
M4  (via drill 0.35)  (2 unrouted)
  Top 0.508: U$11.P$6 32.97,11.99 32.13,12.83 32.13,13.59 v29.97,15.75
  Bottom 0.381: IC2.7 6.53,27.63 6.48,27.69 6.48,28.28
  Bottom 0.508: IC2.8 6.48,28.28 5.25,28.28 4.32,29.21 4.32,31.37 5.97,33.02 8.25,33.02 9.42,31.85 9.42,27.62 10.21,26.84 10.21,15.36 13.76,11.81 19.75,11.81 | v29.97,15.75 28.73,14.5 28.12,14.5 27.66,14.04 27.66,13.44 27.05,12.83 23.75,12.83 22.73,11.81 20.63,11.81
N$1  (via drill 0.35)
  Top 0.152: J1.D-1 4.87,11.43 6.1,11.43 9.78,7.75 10.54,7.75 11.94,6.35 11.94,4.67 13.46,3.14 13.46,1.9 14.22,1.14 16.64,1.14 v17.02,1.52
  Bottom 0.152: v17.02,1.52 17.08,1.58 R19.2
N$2  (via drill 0.35)
  Top 0.152: J1.D+1 5.08,10.57 5.65,10.57 9.52,6.71 v9.52,4.57
  Bottom 0.152: R20.2 10.25,3.56 9.52,4.29 v9.52,4.57
N$3  (via drill 0.35)
  Top 0.152: 26.54,34.92 S1.2 26.9,35.53 v27.81,36.45 | v34.27,35.74 34.27,34.24 34.5,34.02 34.5,29.93 34.04,29.46 v32,29.46
  Bottom 0.152: U$1.44 28,31.24 | 28,31.24 U$1.45 | v32,29.46 31.59,29.88 31.59,30.32 31.62,30.35 | v27.81,36.45 33.56,36.45 v34.27,35.74 | R5.2 31.62,30.35 | 31.62,30.35 31.08,30.35 30.35,31.09 28.15,31.09 28,31.24
N$4
  Top 0.152: Q1.2 14.24,13.21 9.21,13.21 R6.2
N$5
  Top 0.152: Q1.1 Q2.3 9.86,14.78 8.76,15.88 | R1.1 7.81,16.82 8.76,15.88 | 8.76,15.88 9.37,16.48 9.37,17.77 10.73,19.13 R4.1
N$6
  Bottom 0.152: U$1.5 24.48,28.11 24.48,23.27 24.45,23.24 | C10.1 24.45,23.24 | 24.45,23.24 24.45,23.46 X1.P$1
N$7
  Top 0.152: R7.1 17.4,35.69 18.16,34.92 19.84,34.92 S1.1
N$8
  Top 0.152: Q2.1 13.91,18.88 R2.1 R3.1
N$10  (via drill 3.05)
  other vias: 5.97,3.17
N$11  (via drill 3.05)
  other vias: 40.26,3.17
N$14  (via drill 0.35)
  Top 0.152: v30.23,37.85 30.47,37.6 U$12.P$2
  Bottom 0.152: R16.1 30.1,37.97 v30.23,37.85
N$15
  Bottom 1.016: R10.2 R12.2
N$16  (via drill 3.05)
  other vias: 40.26,56.52
N$18  (via drill 3.05)
  other vias: 5.97,56.52
N$19
  Bottom 0.152: Q3.1 35.63,24.84 35.46,24.67 35.46,24.35 R21.1
N$21
  Top 0.152: LED1.A 8.05,27.62 R14.1
N$22
  Top 0.508: LED2.A 43.75,28.57 R15.1
N$42
  Bottom 1.016: R11.2 R10.1
N$54  (via drill 0.35)
  Top 0.152: S2.2 16.63,38.73 16.42,38.94 16.42,39.97 15.88,40.51 v14.22,40.51
  Bottom 0.152: v14.22,40.51 13.27,39.56 R9.2
N$55
  Bottom 0.152: 19.94,22.95 20.46,23.48 | 20.46,23.48 X1.P$2 21.97,23.5 22.48,24 22.48,25.5 24,27.02 U$1.6 | C12.1 20.46,21.16 20.46,23.48
RESET  (via drill 0.35)
  Top 0.152: 35.81,38.73 J2.10 | S2.1 29.34,38.73 | 29.34,38.73 31.48,38.73 31.97,38.24 34.36,38.24 34.86,38.73 35.81,38.73 | 35.81,38.73 35.81,42.04 v36.32,42.55 | v24.77,30.35 25.65,31.24 25.65,31.75 26.16,32.26 27.56,32.26 28.7,33.4 28.7,35.56 29.34,36.2 29.34,38.73
  Bottom 0.152: v36.32,42.55 36.45,42.67 R8.1 | U$1.7 23.5,29.09 v24.77,30.35
RXD  (via drill 0.35)
  Top 0.152: v34.29,43.94 33.37,43.03 33.37,42.8 31.82,41.25 27.69,41.25 27.21,40.77 v26.92,40.77
  Bottom 0.152: U$1.31 24.14,36.78 24.14,39.73 25.53,41.12 26.03,41.12 26.38,40.77 v26.92,40.77 | v34.29,43.94 34.53,43.94 35.6,45.01 37.29,45.01 37.43,44.88 37.43,42.84 JP1.8
SCL  (via drill 0.35)
  Top 0.152: U$6.P$4 v7.11,46.38 U$5.P$4 U$4.P$4 U$3.P$4 v34.04,46.38 U$2.P$4 | U$7.P$3 13.46,35.18 v8,35.18 5.99,35.18 U$8.P$3 | v31.54,33.4 31.84,33.7 31.84,34.02 31.97,34.15 32.29,34.15 33.46,35.32 33.46,36.76 34.54,37.85 v35.69,37.85
  Bottom 0.152: v7.11,46.38 9.95,46.38 R18.1 8,43.24 v8,35.18 | U$1.42 30.48,32.64 31.24,33.4 v31.54,33.4 | v35.69,37.85 35.69,39.27 32.16,42.8 32.16,43.3 34.04,45.18 v34.04,46.38
SDA  (via drill 0.35)
  Top 0.152: U$6.P$3 v8.38,47.62 | v16.13,47.62 U$5.P$3 | U$4.P$3 v24.89,47.62 U$3.P$3 U$2.P$3 | U$2.P$3 | 13.78,36.58 13.71,36.64 U$7.P$2 7.62,36.57 | U$8.P$2 5.85,36.57 7.62,36.57 | v6.35,39.37 7.62,38.1 7.62,36.57 | v37.85,31.37 34.8,28.32 31.24,28.32 31.11,28.45 31.11,29.59 32.64,31.11 v32.64,31.62 | v39.5,34.29 39.5,40.29 42.29,43.08 42.29,44.7 42.29,46.82 42.15,46.95 41.82,46.95 U$2.P$3
  Bottom 0.152: 12.45,47.62 v8.38,47.62 4.7,47.62 3.94,46.86 3.94,41.78 v6.35,39.37 | 12.45,47.62 v16.13,47.62 16.79,48.29 16.79,51.43 17.15,51.79 17.65,51.79 21.81,47.62 v24.89,47.62 | R17.1 12.45,47.62 | v37.85,31.37 38.12,31.65 38.66,31.65 39.5,32.49 v39.5,34.29 | v32.64,31.62 32.13,32.14 U$1.43
SWDCLK
  Bottom 0.152: U$1.37 35.6,35.14 J2.4
SWDIO  (via drill 0.35)
  Top 0.152: v35.18,35.94 35.18,34.29 J2.2 | v36.58,40.13 36.58,41.94 36.93,42.29 36.93,42.8 36.57,43.15 36.07,43.15 33.56,40.64 v27.94,40.64
  Bottom 0.152: U$1.34 25.5,38.2 v27.94,40.64 | v36.58,40.13 36.58,38 36.35,37.77 36.35,37.11 v35.18,35.94
TXD  (via drill 0.35)
  Top 0.152: v27.94,42.04 27.98,42.04 28.37,41.65 31.36,41.65 v32.77,43.05
  Bottom 0.152: 28.07,42.16 v27.94,42.04 | v27.94,42.04 | JP1.1 44.07,31.75 42.52,33.3 42.52,34.06 41.94,34.65 41.17,34.65 39.09,36.73 39.09,38.48 36.83,40.74 35.08,40.74 v32.77,43.05 | U$1.30 23.5,39.63 25.4,41.53 27.69,41.53 27.94,41.78 v27.94,42.04
VBUS
  Top 0.508: J1.VBUS1 5.96,12.09 6.05,12.19 6.05,14.99 | D1.A 7.88,21.21 6.05,19.39 6.05,14.99 | R1.2 6.12,14.93 6.05,14.99

### Text on the board
tPlace: VACUUM MAINBOARD V1.0 | Minh7a6 | VL53L0X | RESET | ESP-01 | MPU6050 | I2C | BUZZER | BOOT | BUMPERS | V+ | V- | MOTOR2 | MOTOR1